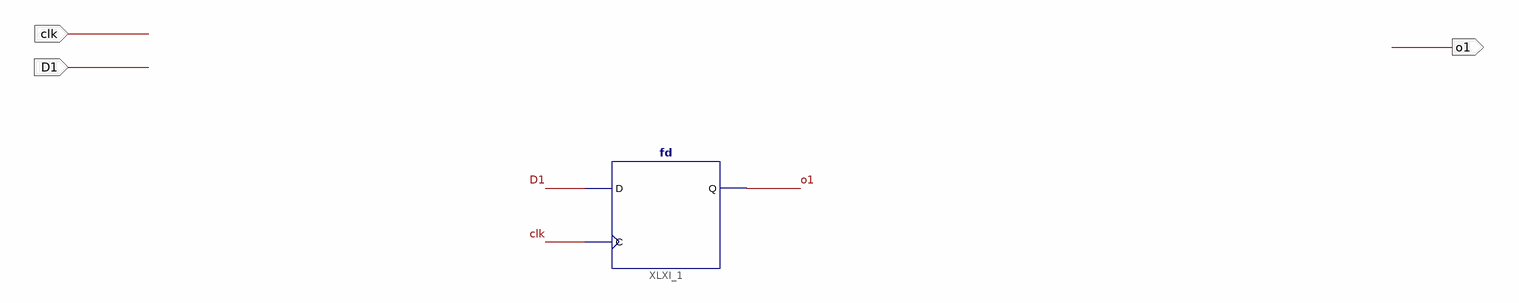
[diagram p0: schematic sheet 1]
// Xilinx ISE schematic main.sch (spartan6) as structural Verilog: 1 symbols, 3 ports
module main (
  input  clk,
  input  D1,
  output o1
);

  fd XLXI_1 (.C(clk), .D(D1), .Q(o1));
endmodule
